# Altium schematic sheet Amplifier.SchDoc: Amplifier
size A4; DrawnBy: Ian Glass; Address1: Auckland Bioengineering; Address2: Institute; Address3: Auckland, 1010; Address4: New Zealand; Revision: 1; SheetNumber: 4; SheetTotal: 4
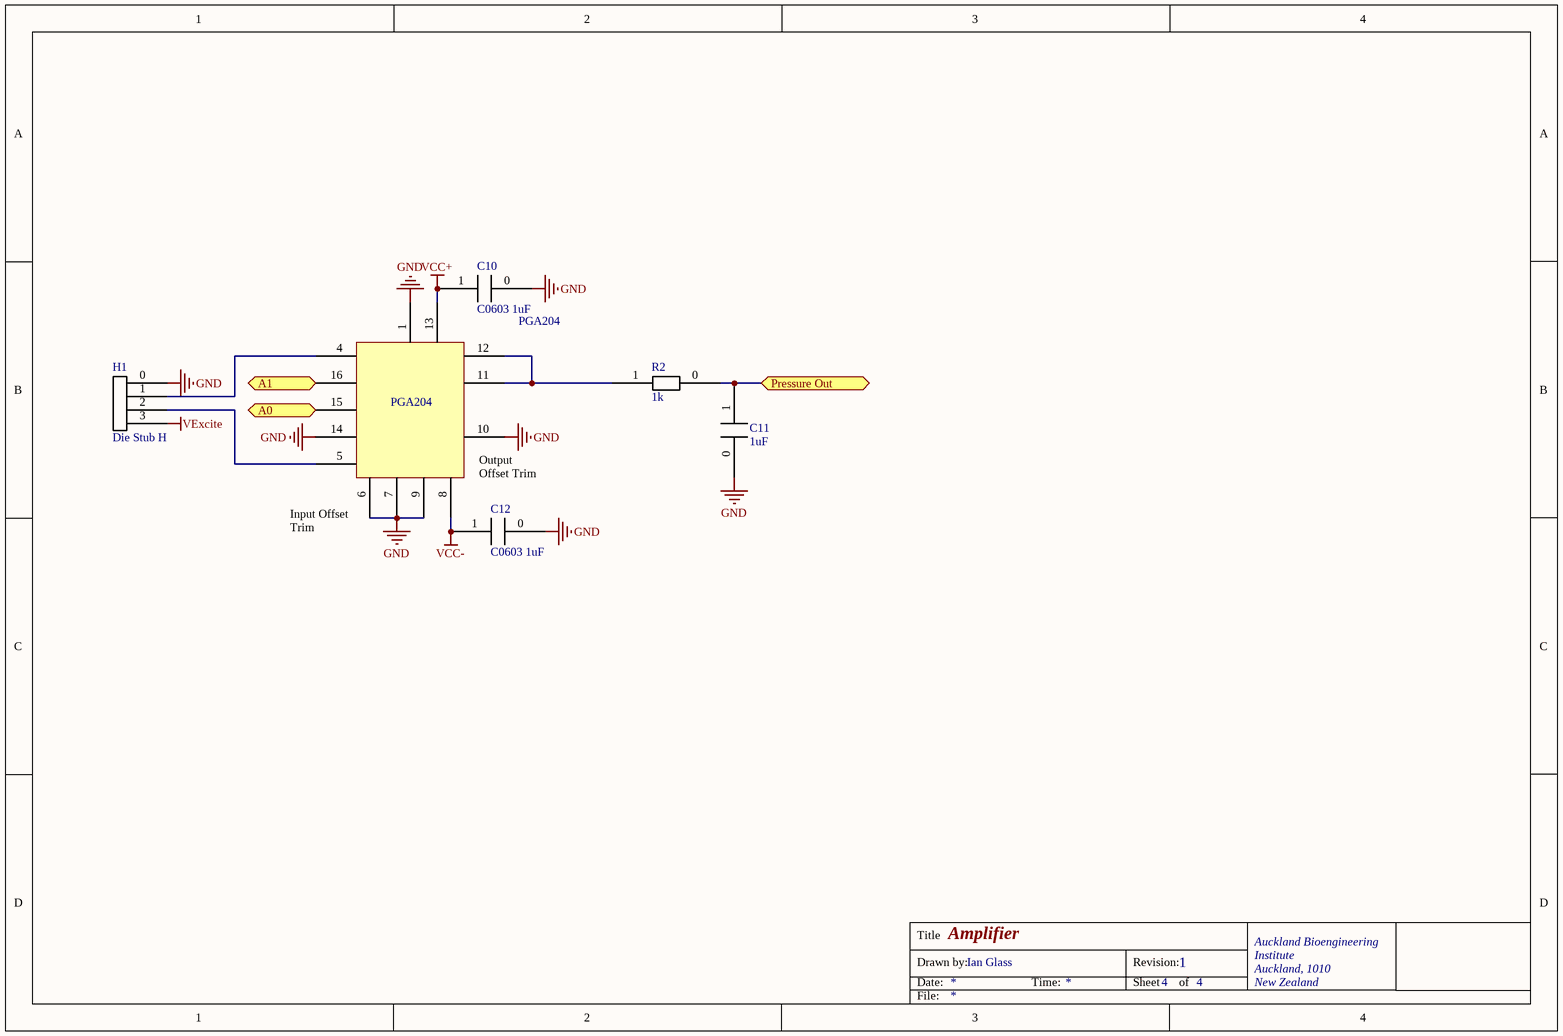
[diagram p0: Amplifier.SchDoc]

## Parts
C10  C0603 1uF  [C0603 1uF]
C11  1uF  [C0603 1uF]
C12  C0603 1uF  [C0603 1uF]
H1  Die Stub H  [Header1x4]
PGA204  PGA204  [PGA204]  (value not drawn)
R2  1k  [RT0603 330k]

## Ports
A0, A1, Pressure Out

## Nets
GND: C10.0 C11.0 C12.0 H1.0 PGA204.1 PGA204.6 PGA204.7 PGA204.9 PGA204.10 PGA204.14
VCC+: C10.1 PGA204.13
VCC-: C12.1 PGA204.8
VExcite: H1.3
A0: PGA204.15 ; port A0
A1: PGA204.16 ; port A1
Pressure Out: C11.1 R2.0 ; port Pressure Out
NetH1_1: H1.1 PGA204.4
NetH1_2: H1.2 PGA204.5
NetPGA204_11: PGA204.11 PGA204.12 R2.1

## Notes on the sheet
- (near PGA204) Output Offset Trim
- (near PGA204) Input Offset Trim
- Title
- Drawn by:
- Date:
- Time:
- Revision:
- Sheet
- of
- File:

## Library data of the parts
C11 = C0603 1uF
H1 = Header1x4
R2 = RT0603 330k